# EAGLE schematic dig_ac230 (EAGLE 6.2)

## Sheet 1 of 4
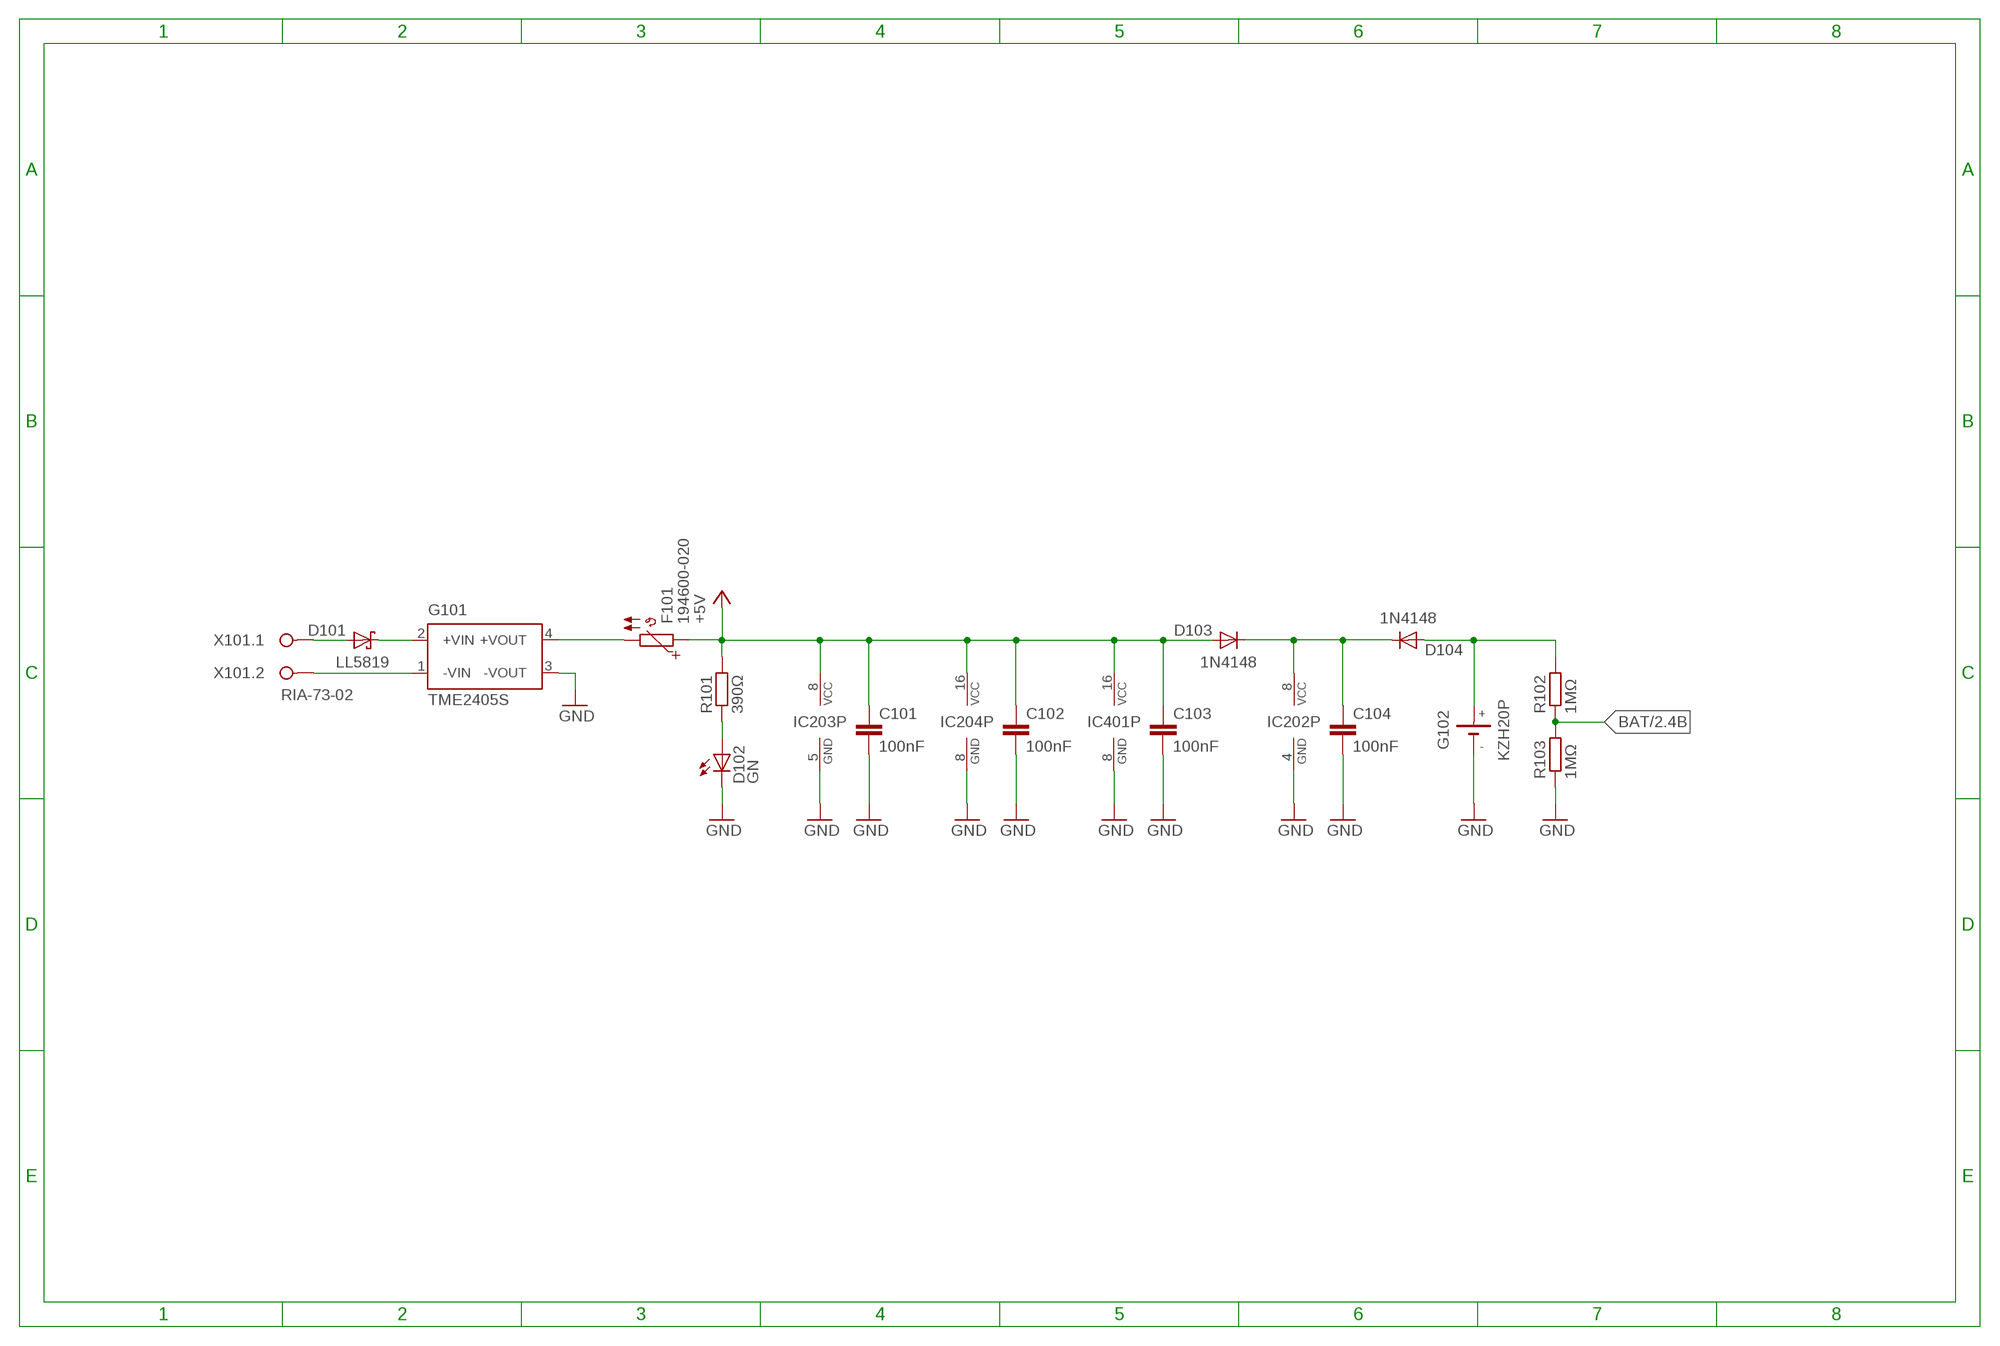
[diagram p0: schematic, sheet 1]

### Parts
C101  100nF  C_0805  [CHIP_0805]
C102  100nF  C_0805  [CHIP_0805]
C103  100nF  C_0805  [CHIP_0805]
C104  100nF  C_0805  [CHIP_0805]
D101  LL5819  SHOTKY-DIODE-MELF  [MELF]
D102  GN  LED3MM  [LED3MM]
D103  1N4148  DIODE-MINIMELF  [MINIMELF]
D104  1N4148  DIODE-MINIMELF  [MINIMELF]
F101  194600-020  [CHIP_1812]
G101  TME2405S  [TME-24V]
G102  KZH20P  [KZH20P]
IC202  DS1337S  [SOP08_127]
IC203  MAX487CSA  [SOP08_127]
IC204  74HC166D  [SOP16_127]
IC401  74HC595D  [SOP16_127]
R101  390Ω  R_0805  [CHIP_0805]
R102  1MΩ  R_0805  [CHIP_0805]
R103  1MΩ  R_0805  [CHIP_0805]
X101  RIA-73-02  [RIA-73-02]

### Nets
+5V: C101.1 C102.1 C103.1 D103.A F101.1 IC203.8(VCC) IC204.16(VCC) IC401.16(VCC) R101.2 ; also sheet 2,3
BAT: R102.1 R103.2 ; also sheet 2
GND: C101.2 C102.2 C103.2 C104.2 D102.K(C) G101.3(-VOUT) G102.N(-) IC202.4(GND) IC203.5(GND) IC204.8(GND) IC401.8(GND) R103.1 ; also sheet 2,3,4
N$19: G101.1(-VIN) X101.2
N$21: D104.A G102.P1(+) G102.P2(+) R102.2
N$23: D101.K G101.2(+VIN)
N$24: D101.A X101.1
N$41: F101.2 G101.4(+VOUT)
N$44: D102.A R101.1
N$64: C104.1 D103.K D104.K IC202.8(VCC)

## Sheet 2 of 4
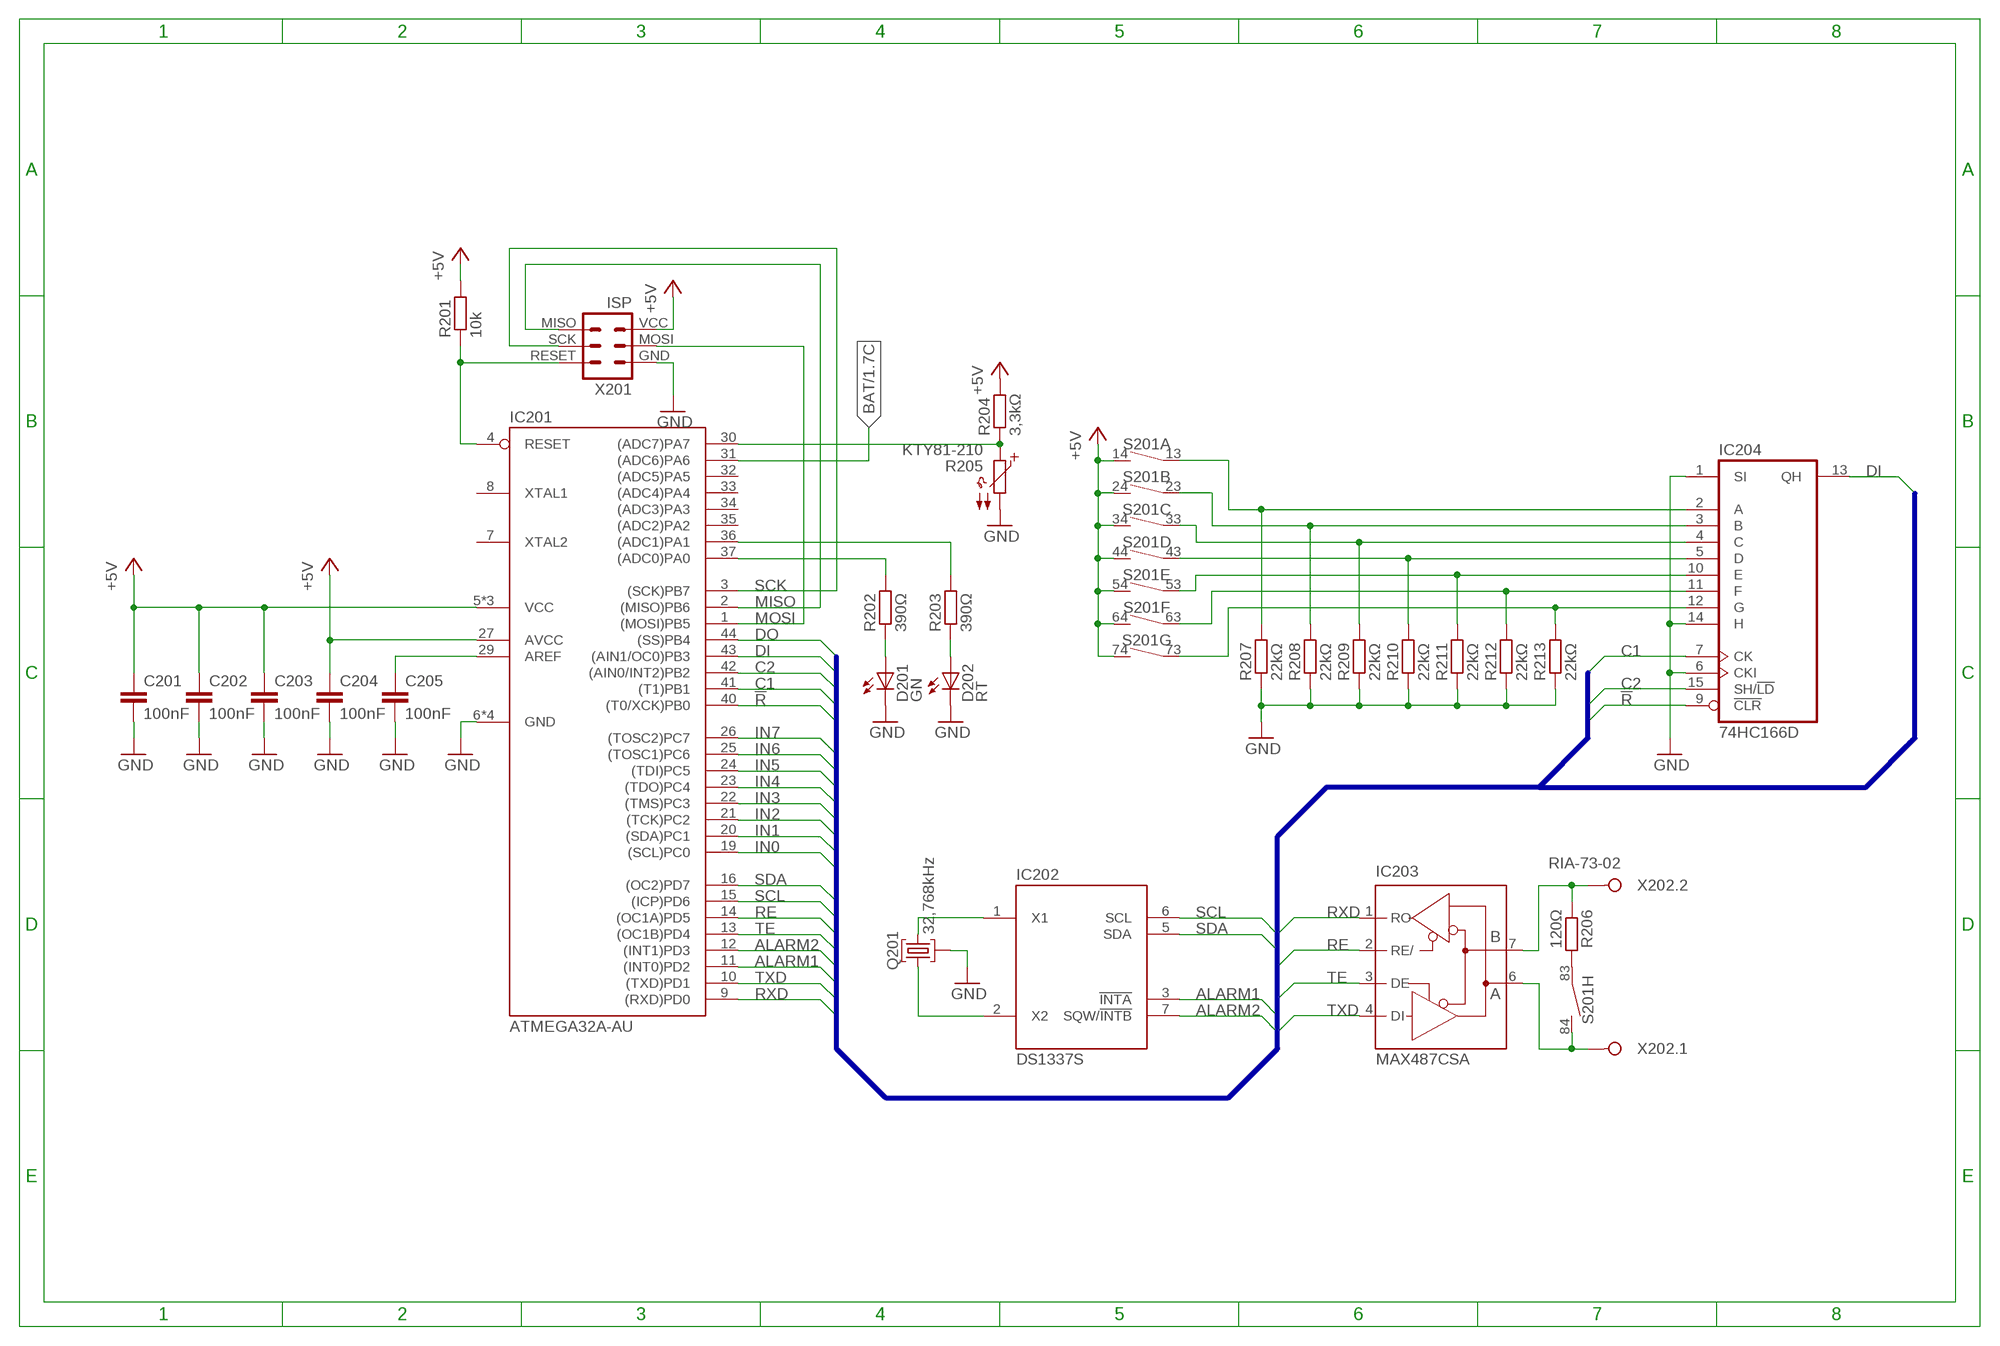
[diagram p1: schematic, sheet 2]

### Parts
C201  100nF  C_0805  [CHIP_0805]
C202  100nF  C_0805  [CHIP_0805]
C203  100nF  C_0805  [CHIP_0805]
C204  100nF  C_0805  [CHIP_0805]
C205  100nF  C_0805  [CHIP_0805]
D201  GN  LED3MM  [LED3MM]
D202  RT  LED3MM  [LED3MM]
IC201  ATMEGA32A-AU  [QFP44_08]
Q201  32,768kHz  QM_  [MS1V-T1K]
R201  10k  R_0805  [CHIP_0805]
R202  390Ω  R_0805  [CHIP_0805]
R203  390Ω  R_0805  [CHIP_0805]
R204  3,3kΩ  R_0805  [CHIP_0805]
R205  KTY81-210  [TO92]
R206  120Ω  R_0805  [CHIP_0805]
R207  22kΩ  R_0805  [CHIP_0805]
R208  22kΩ  R_0805  [CHIP_0805]
R209  22kΩ  R_0805  [CHIP_0805]
R210  22kΩ  R_0805  [CHIP_0805]
R211  22kΩ  R_0805  [CHIP_0805]
R212  22kΩ  R_0805  [CHIP_0805]
R213  22kΩ  R_0805  [CHIP_0805]
S201  DP08  [DP08]
X201  ISP  AVR_ISP6L  [ML6L]
X202  RIA-73-02  [RIA-73-02]

### Nets
!R: IC201.40((T0/XCK)PB0) IC204.9(!CLR) ; also sheet 4
+5V: C201.1 C202.1 C203.1 C204.1 IC201.5(VCC) IC201.17(VCC) IC201.27(AVCC) IC201.38(VCC) R201.2 R204.2 S201.14 S201.24 S201.34 S201.44 S201.54 S201.64 S201.74 X201.VCC ; also sheet 1,3
ALARM1: IC201.11((INT0)PD2) IC202.3(!INTA)
ALARM2: IC201.12((INT1)PD3) IC202.7(SQW/!INTB)
BAT: IC201.31((ADC6)PA6) ; also sheet 1
C1: IC201.41((T1)PB1) IC204.7(CK) ; also sheet 4
C2: IC201.42((AIN0/INT2)PB2) IC204.15(SH/!LD) ; also sheet 4
DI: IC201.43((AIN1/OC0)PB3) IC204.13(QH)
DO: IC201.44((SS)PB4) ; also sheet 4
GND: C201.2 C202.2 C203.2 C204.2 C205.2 D201.K(C) D202.K(C) IC201.6(GND) IC201.18(GND) IC201.28(GND) IC201.39(GND) IC204.1(SI) IC204.6(CKI) IC204.14(H) Q201.G R205.2 R207.1 R208.1 R209.1 R210.1 R211.1 R212.1 R213.1 X201.GND ; also sheet 1,3,4
IN0: IC201.19((SCL)PC0) ; also sheet 3
IN1: IC201.20((SDA)PC1) ; also sheet 3
IN2: IC201.21((TCK)PC2) ; also sheet 3
IN3: IC201.22((TMS)PC3) ; also sheet 3
IN4: IC201.23((TDO)PC4) ; also sheet 3
IN5: IC201.24((TDI)PC5) ; also sheet 3
IN6: IC201.25((TOSC1)PC6) ; also sheet 3
IN7: IC201.26((TOSC2)PC7) ; also sheet 3
MISO: IC201.2((MISO)PB6) X201.MISO
MOSI: IC201.1((MOSI)PB5) X201.MOSI
N$20: IC203.6(A) S201.84 X202.1
N$22: IC203.7(B) R206.1 X202.2
N$25: C205.1 IC201.29(AREF)
N$26: IC204.2(A) R207.2 S201.13
N$27: IC204.3(B) R208.2 S201.23
N$28: IC204.4(C) R209.2 S201.33
N$29: IC204.5(D) R210.2 S201.43
N$30: IC204.10(E) R211.2 S201.53
N$31: IC204.11(F) R212.2 S201.63
N$32: IC204.12(G) R213.2 S201.73
N$33: R206.2 S201.83
N$42: IC201.4(RESET) R201.1 X201.RESET
N$61: IC201.30((ADC7)PA7) R204.1 R205.1
N$62: D201.A R202.1
N$63: D202.A R203.1
N$90: IC201.37((ADC0)PA0) R202.2
N$92: IC201.36((ADC1)PA1) R203.2
N$126: IC202.1(X1) Q201.2
N$127: IC202.2(X2) Q201.1
RE: IC201.14((OC1A)PD5) IC203.2(RE/)
RXD: IC201.9((RXD)PD0) IC203.1(RO)
SCK: IC201.3((SCK)PB7) X201.SCK
SCL: IC201.15((ICP)PD6) IC202.6(SCL)
SDA: IC201.16((OC2)PD7) IC202.5(SDA)
TE: IC201.13((OC1B)PD4) IC203.3(DE)
TXD: IC201.10((TXD)PD1) IC203.4(DI)
Unconnected: IC201.7(XTAL2) IC201.8(XTAL1) IC201.32((ADC5)PA5) IC201.33((ADC4)PA4) IC201.34((ADC3)PA3) IC201.35((ADC2)PA2)

### Buses
IN[0..7],C1,C2,DO,DI,!R,RXD,TXD,RE,TE,SCL,SDA,ALARM1,ALARM2

## Sheet 3 of 4
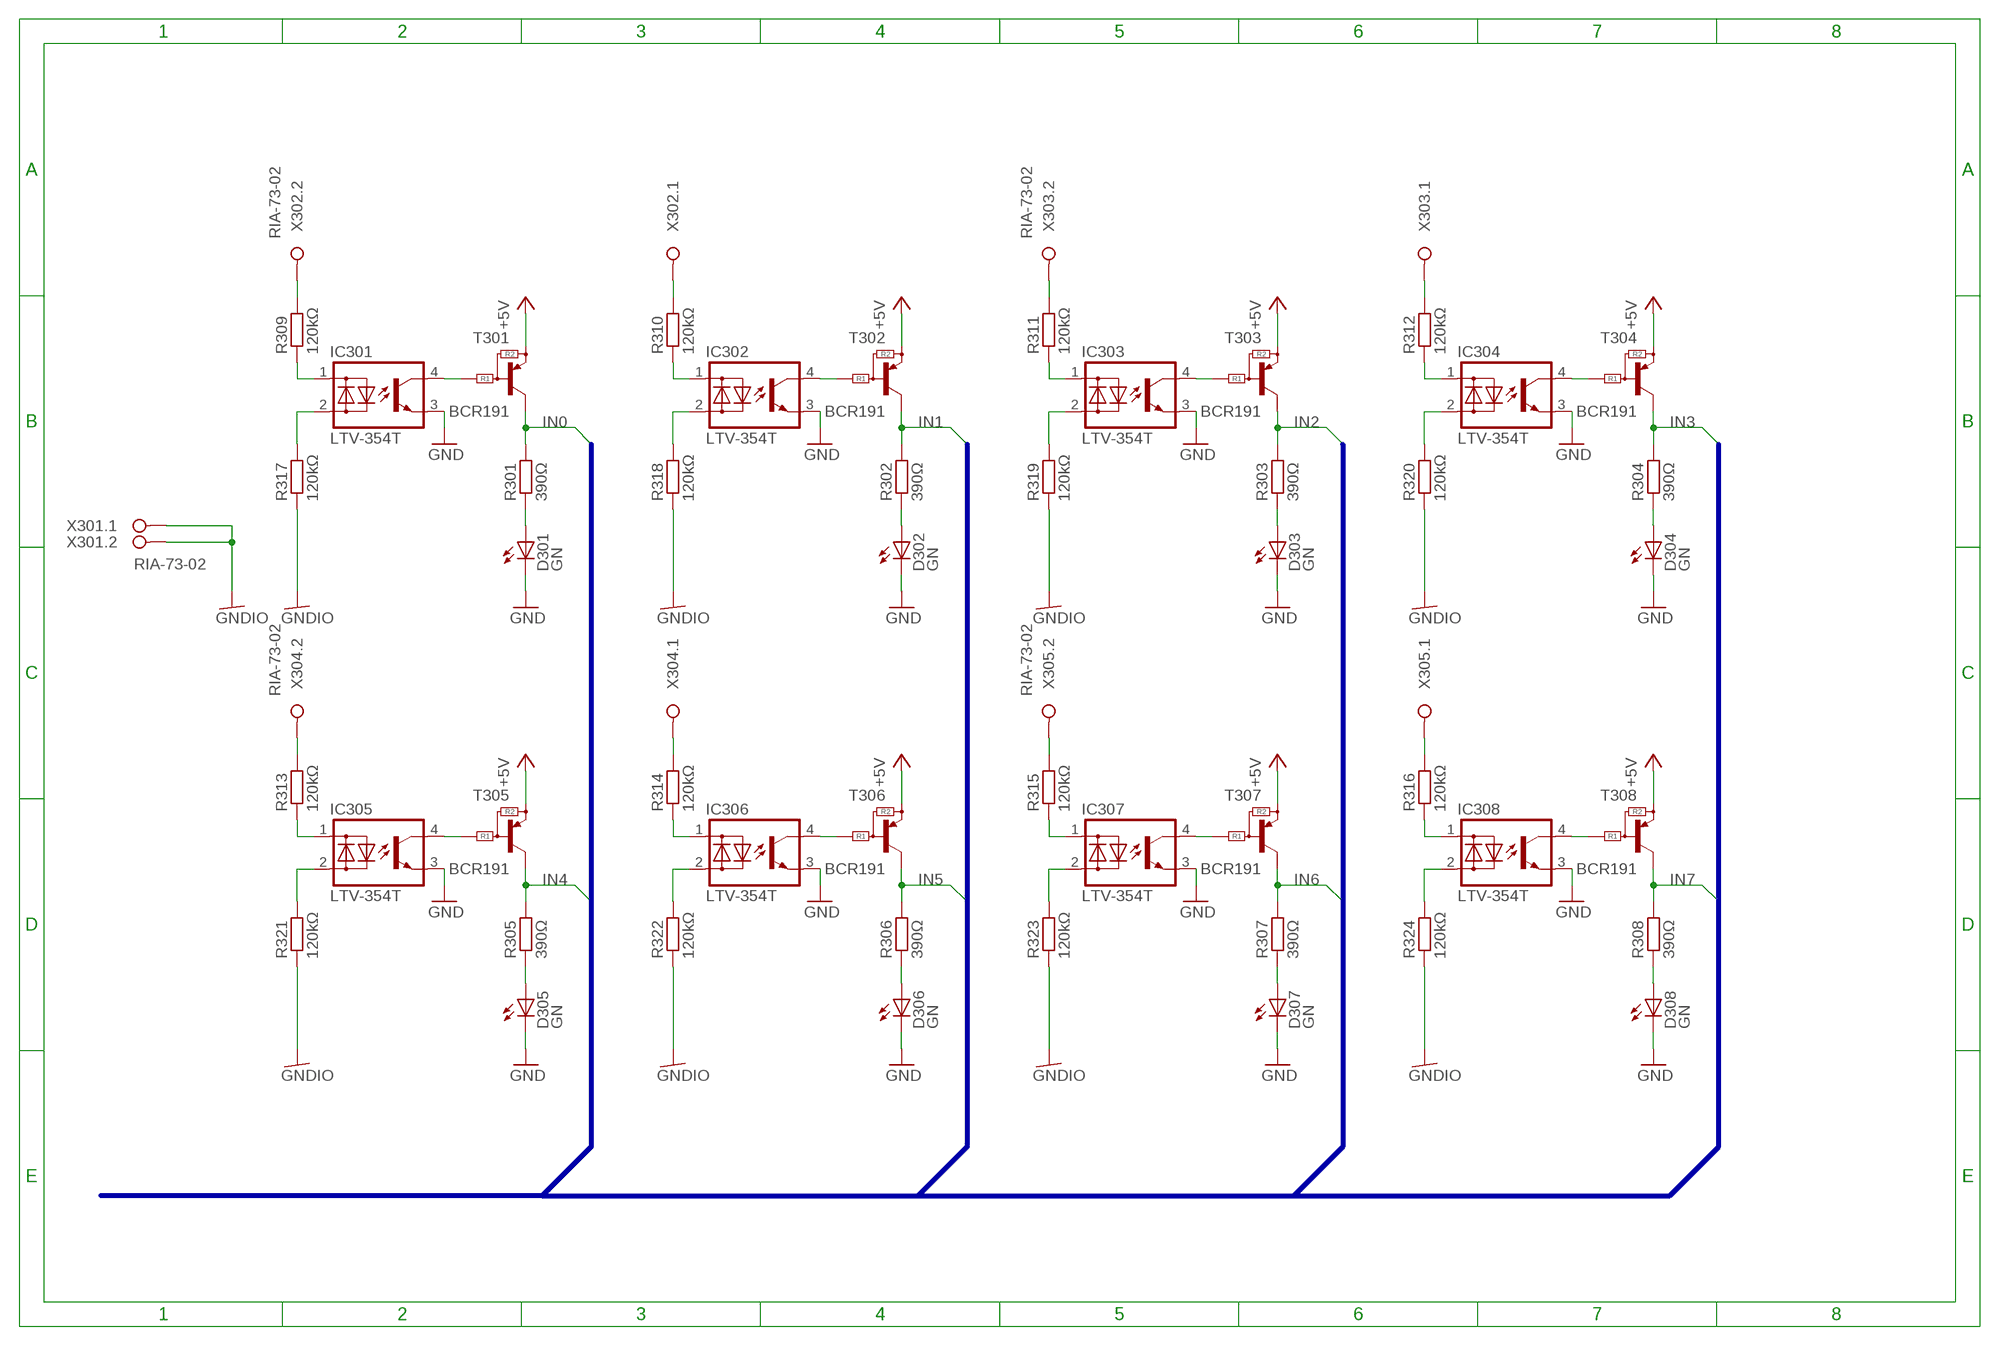
[diagram p2: schematic, sheet 3]

### Parts
D301  GN  LED3MM  [LED3MM]
D302  GN  LED3MM  [LED3MM]
D303  GN  LED3MM  [LED3MM]
D304  GN  LED3MM  [LED3MM]
D305  GN  LED3MM  [LED3MM]
D306  GN  LED3MM  [LED3MM]
D307  GN  LED3MM  [LED3MM]
D308  GN  LED3MM  [LED3MM]
IC301  LTV-354T  [SOP04_254]
IC302  LTV-354T  [SOP04_254]
IC303  LTV-354T  [SOP04_254]
IC304  LTV-354T  [SOP04_254]
IC305  LTV-354T  [SOP04_254]
IC306  LTV-354T  [SOP04_254]
IC307  LTV-354T  [SOP04_254]
IC308  LTV-354T  [SOP04_254]
R301  390Ω  R_0805  [CHIP_0805]
R302  390Ω  R_0805  [CHIP_0805]
R303  390Ω  R_0805  [CHIP_0805]
R304  390Ω  R_0805  [CHIP_0805]
R305  390Ω  R_0805  [CHIP_0805]
R306  390Ω  R_0805  [CHIP_0805]
R307  390Ω  R_0805  [CHIP_0805]
R308  390Ω  R_0805  [CHIP_0805]
R309  120kΩ  R_1206  [CHIP_1206]
R310  120kΩ  R_1206  [CHIP_1206]
R311  120kΩ  R_1206  [CHIP_1206]
R312  120kΩ  R_1206  [CHIP_1206]
R313  120kΩ  R_1206  [CHIP_1206]
R314  120kΩ  R_1206  [CHIP_1206]
R315  120kΩ  R_1206  [CHIP_1206]
R316  120kΩ  R_1206  [CHIP_1206]
R317  120kΩ  R_1206  [CHIP_1206]
R318  120kΩ  R_1206  [CHIP_1206]
R319  120kΩ  R_1206  [CHIP_1206]
R320  120kΩ  R_1206  [CHIP_1206]
R321  120kΩ  R_1206  [CHIP_1206]
R322  120kΩ  R_1206  [CHIP_1206]
R323  120kΩ  R_1206  [CHIP_1206]
R324  120kΩ  R_1206  [CHIP_1206]
T301  BCR191  PNP2R-SOT23-BEC  [SOT23]
T302  BCR191  PNP2R-SOT23-BEC  [SOT23]
T303  BCR191  PNP2R-SOT23-BEC  [SOT23]
T304  BCR191  PNP2R-SOT23-BEC  [SOT23]
T305  BCR191  PNP2R-SOT23-BEC  [SOT23]
T306  BCR191  PNP2R-SOT23-BEC  [SOT23]
T307  BCR191  PNP2R-SOT23-BEC  [SOT23]
T308  BCR191  PNP2R-SOT23-BEC  [SOT23]
X301  RIA-73-02  [RIA-73-02]
X302  RIA-73-02  [RIA-73-02]
X303  RIA-73-02  [RIA-73-02]
X304  RIA-73-02  [RIA-73-02]
X305  RIA-73-02  [RIA-73-02]

### Nets
+5V: T301.2(E) T302.2(E) T303.2(E) T304.2(E) T305.2(E) T306.2(E) T307.2(E) T308.2(E) ; also sheet 1,2
GND: D301.K(C) D302.K(C) D303.K(C) D304.K(C) D305.K(C) D306.K(C) D307.K(C) D308.K(C) IC301.3(E) IC302.3(E) IC303.3(E) IC304.3(E) IC305.3(E) IC306.3(E) IC307.3(E) IC308.3(E) ; also sheet 1,2,4
GNDIO [netz]: R317.1 R318.1 R319.1 R320.1 R321.1 R322.1 R323.1 R324.1 X301.1 X301.2
IN0: R301.2 T301.3(C) ; also sheet 2
IN1: R302.2 T302.3(C) ; also sheet 2
IN2: R303.2 T303.3(C) ; also sheet 2
IN3: R304.2 T304.3(C) ; also sheet 2
IN4: R305.2 T305.3(C) ; also sheet 2
IN5: R306.2 T306.3(C) ; also sheet 2
IN6: R307.2 T307.3(C) ; also sheet 2
IN7: R308.2 T308.3(C) ; also sheet 2
N$1 [netz]: R309.2 X302.2
N$2 [netz]: IC301.1(A) R309.1
N$3 [netz]: IC301.2(K) R317.2
N$4 [netz]: R310.2 X302.1
N$5 [netz]: IC302.1(A) R310.1
N$6 [netz]: IC302.2(K) R318.2
N$7 [netz]: R311.2 X303.2
N$8 [netz]: IC303.1(A) R311.1
N$9 [netz]: IC303.2(K) R319.2
N$10 [netz]: R312.2 X303.1
N$11 [netz]: IC304.1(A) R312.1
N$12 [netz]: IC304.2(K) R320.2
N$13 [netz]: R313.2 X304.2
N$14 [netz]: IC305.1(A) R313.1
N$15 [netz]: IC305.2(K) R321.2
N$16 [netz]: R314.2 X304.1
N$34: D304.A R304.1
N$35 [netz]: IC306.1(A) R314.1
N$36: D303.A R303.1
N$37 [netz]: IC306.2(K) R322.2
N$38: D302.A R302.1
N$39 [netz]: IC307.1(A) R315.1
N$40: D301.A R301.1
N$50 [netz]: IC307.2(K) R323.2
N$52: IC304.4(C) T304.1(B)
N$55: D305.A R305.1
N$57 [netz]: R315.2 X305.2
N$65: D306.A R306.1
N$67 [netz]: R316.2 X305.1
N$69: D307.A R307.1
N$70: IC303.4(C) T303.1(B)
N$71 [netz]: IC308.1(A) R316.1
N$73: IC302.4(C) T302.1(B)
N$75: IC301.4(C) T301.1(B)
N$77: D308.A R308.1
N$79 [netz]: IC308.2(K) R324.2
N$80: IC305.4(C) T305.1(B)
N$81: IC306.4(C) T306.1(B)
N$83: IC307.4(C) T307.1(B)
N$85: IC308.4(C) T308.1(B)

### Buses
IN[0..7],C1,C2,DO,DI,!R,RXD,TXD,RE,TE,SCL,SDA,ALARM1,ALARM2

## Sheet 4 of 4
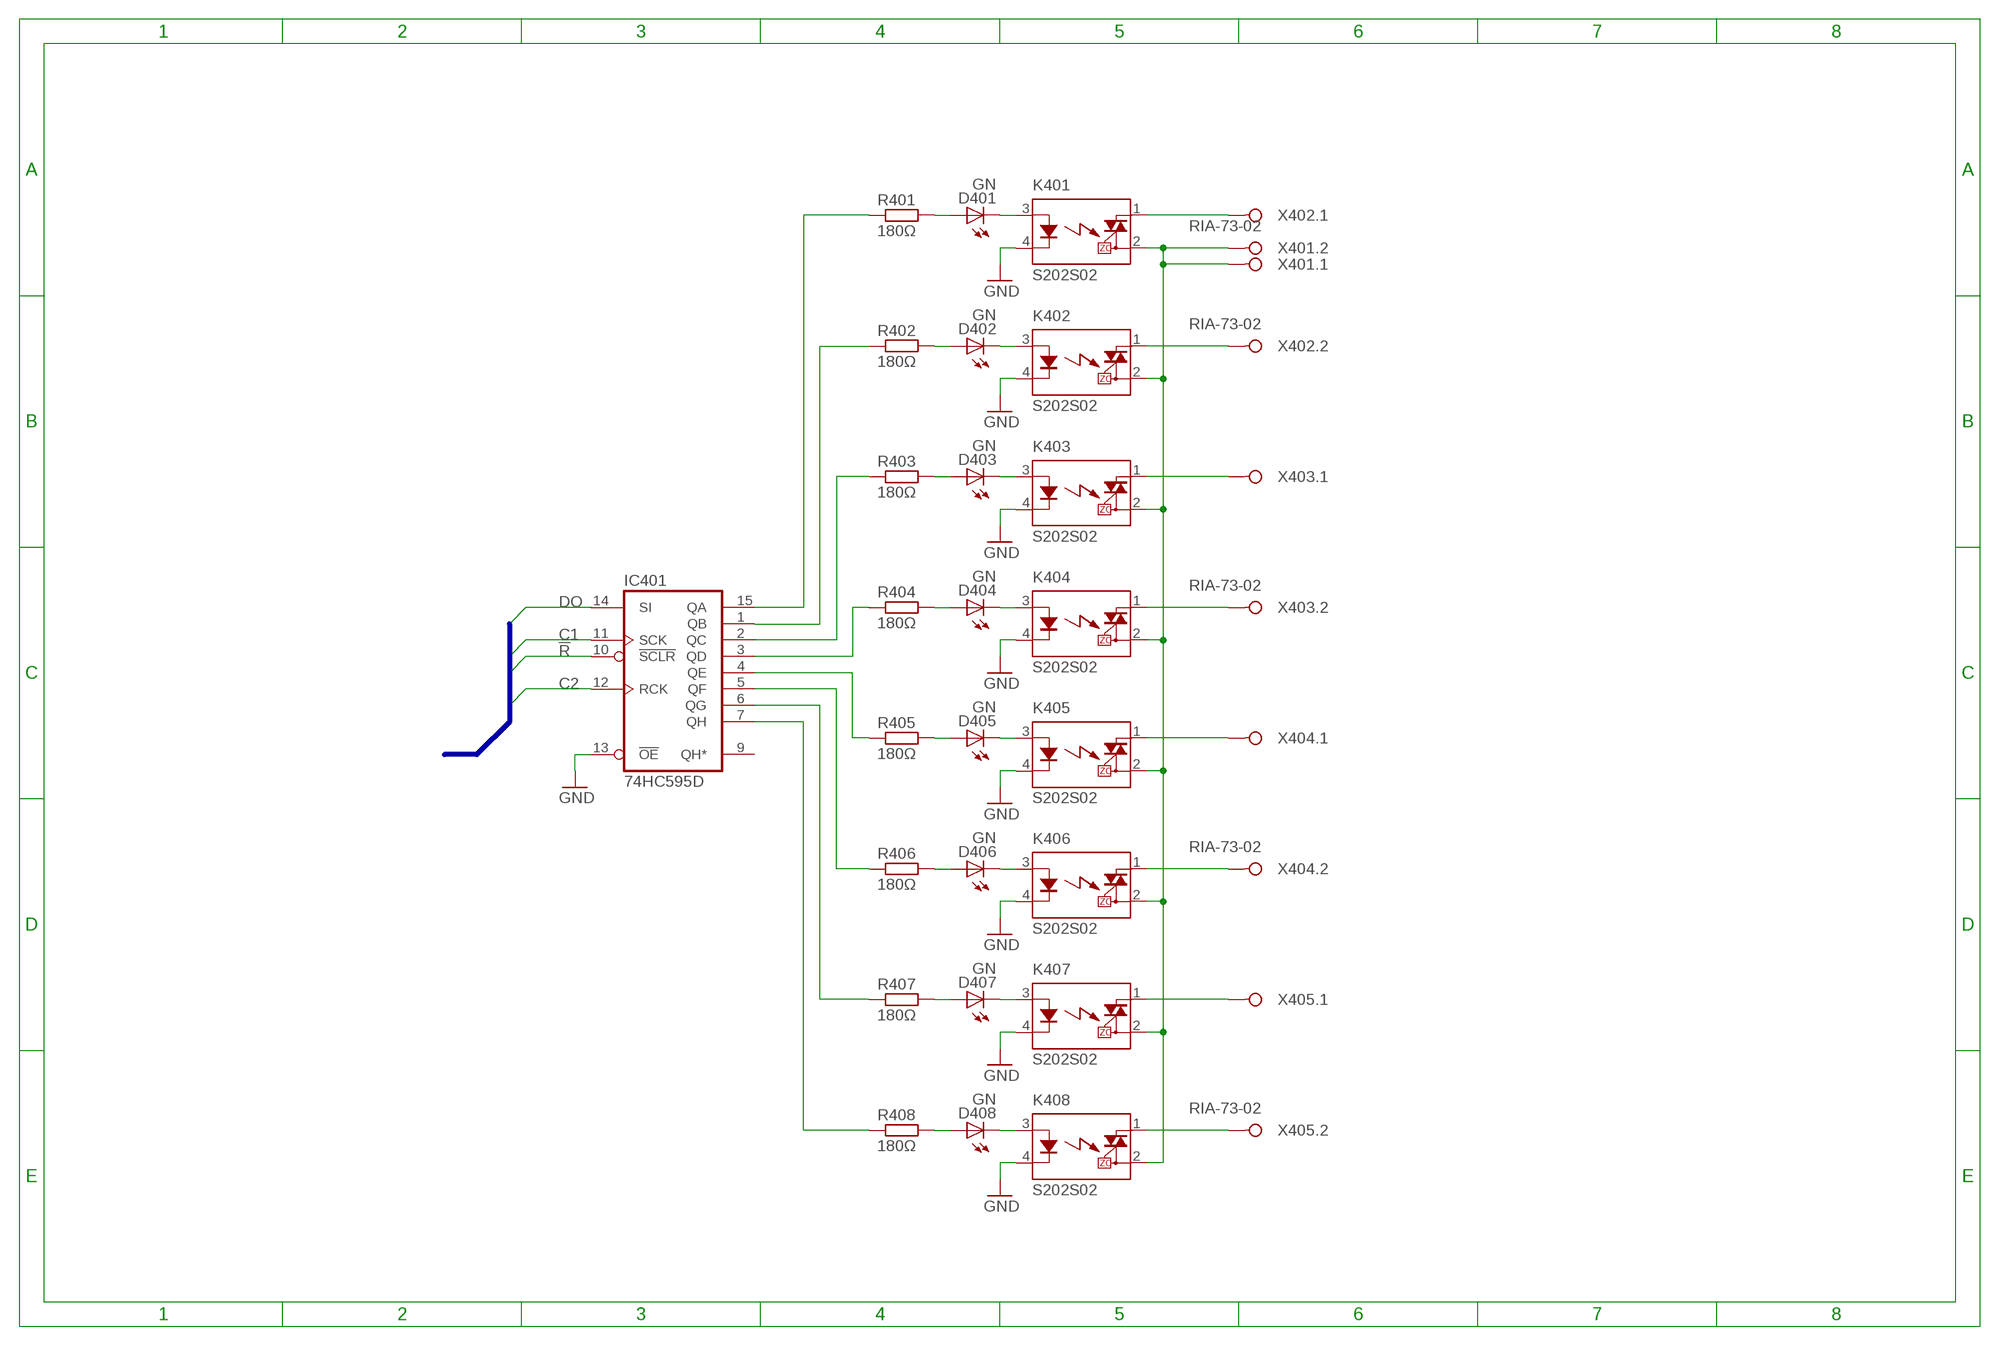
[diagram p3: schematic, sheet 4]

### Parts
D401  GN  LED3MM  [LED3MM]
D402  GN  LED3MM  [LED3MM]
D403  GN  LED3MM  [LED3MM]
D404  GN  LED3MM  [LED3MM]
D405  GN  LED3MM  [LED3MM]
D406  GN  LED3MM  [LED3MM]
D407  GN  LED3MM  [LED3MM]
D408  GN  LED3MM  [LED3MM]
K401  S202S02  [SIP4]
K402  S202S02  [SIP4]
K403  S202S02  [SIP4]
K404  S202S02  [SIP4]
K405  S202S02  [SIP4]
K406  S202S02  [SIP4]
K407  S202S02  [SIP4]
K408  S202S02  [SIP4]
R401  180Ω  R_0805  [CHIP_0805]
R402  180Ω  R_0805  [CHIP_0805]
R403  180Ω  R_0805  [CHIP_0805]
R404  180Ω  R_0805  [CHIP_0805]
R405  180Ω  R_0805  [CHIP_0805]
R406  180Ω  R_0805  [CHIP_0805]
R407  180Ω  R_0805  [CHIP_0805]
R408  180Ω  R_0805  [CHIP_0805]
X401  RIA-73-02  [RIA-73-02]
X402  RIA-73-02  [RIA-73-02]
X403  RIA-73-02  [RIA-73-02]
X404  RIA-73-02  [RIA-73-02]
X405  RIA-73-02  [RIA-73-02]

### Nets
!R: IC401.10(!SCLR) ; also sheet 2
C1: IC401.11(SCK) ; also sheet 2
C2: IC401.12(RCK) ; also sheet 2
DO: IC401.14(SI) ; also sheet 2
GND: IC401.13(!OE) K401.4(K) K402.4(K) K403.4(K) K404.4(K) K405.4(K) K406.4(K) K407.4(K) K408.4(K) ; also sheet 1,2,3
L [netz]: K401.2(DS2) K402.2(DS2) K403.2(DS2) K404.2(DS2) K405.2(DS2) K406.2(DS2) K407.2(DS2) K408.2(DS2) X401.1 X401.2
N$17: D401.K(C) K401.3(A)
N$18: D402.K(C) K402.3(A)
N$43: D403.K(C) K403.3(A)
N$45: D404.K(C) K404.3(A)
N$46: D405.K(C) K405.3(A)
N$47: D406.K(C) K406.3(A)
N$48: D407.K(C) K407.3(A)
N$49: D408.K(C) K408.3(A)
N$51: IC401.15(QA) R401.1
N$53: IC401.1(QB) R402.1
N$54: IC401.2(QC) R403.1
N$56: IC401.3(QD) R404.1
N$58: IC401.4(QE) R405.1
N$59: IC401.5(QF) R406.1
N$60: IC401.6(QG) R407.1
N$66: IC401.7(QH) R408.1
N$68 [netz]: K401.1(DS1) X402.1
N$72 [netz]: K402.1(DS1) X402.2
N$74 [netz]: K403.1(DS1) X403.1
N$76 [netz]: K404.1(DS1) X403.2
N$78 [netz]: K405.1(DS1) X404.1
N$82 [netz]: K406.1(DS1) X404.2
N$84 [netz]: K407.1(DS1) X405.1
N$89 [netz]: K408.1(DS1) X405.2
N$103: D401.A R401.2
N$104: D402.A R402.2
N$105: D403.A R403.2
N$106: D404.A R404.2
N$107: D405.A R405.2
N$108: D406.A R406.2
N$109: D407.A R407.2
N$110: D408.A R408.2
Unconnected: IC401.9(QH*)

### Buses
IN[0..7],C1,C2,DO,DI,!R,RXD,TXD,RE,TE,SCL,SDA,ALARM1,ALARM2

## Library data of the parts
C101-C104 C201-C205 = passiv:C_: CAPACITOR, European symbol
D101 = diode:SHOTKY-DIODE
D102 D201 D202 D301-D308 D401-D408 = led:LED: LED
D103 D104 = diode:DIODE
F101 = sicherung:194600-*: Selbstrückstellende Sicherung / PTC-Fuse Datasheet: 194600.pdf <./eagle/doc/sicherung/194600.pdf>
G101 = schaltregler:TME?*: DC/DC Converter TME Series 1 Watt traco_tme.pdf <./eagle/doc/schaltregler/traco_tme.pdf>; MPN: TME 2405S; OC_FARNELL: 1007547; OC_NEWARK: 51R5329
G102 = batterie:KZH20: Knopfzellenhalter
IC201 = ic-mcu:ATMEGA32A: Microcontroller Typ Flash SRAM EEPROM GPIO ADC DAC PWM Timer Ports ATmega32A <./eagle/doc/ic-mcu/atmega32a.pdf> 32kB 2kB 1kB 32 8x 10bit 2x 8bit, 2x 16bit 2x 8bit, 1x 16bit JTAG, USART, I2C, SPI
IC202 = ic-controller:DS1337: Echtzeituhr Datasheet: ds1337.pdf <./eagle/doc/ic-controller/ds1337.pdf>
IC203 = ic-wandler:MAX48*: RS485 TRANSEIVER Datasheet: max1487-max491.pdf <./eagle/doc/ic-wandler/max1487-max491.pdf> Part Number Half- / Fullduplex Datarate (Mbps) Slew-Rate limited Low-Power shutdown Receiver / Driver enable Quiescent current (μA) Number of Receivers un bus MAX481 Half 2.5 No Yes Yes 300 32 MAX483 Half 0.25 Yes Yes Yes 120 32 MAX485 Half 2.5 No No Yes 300 32 MAX487 Half 0.25 Yes Yes Yes 120 128
IC204 = ic-logik:74*166: 8Bit Schiberegister PISO Datasheet: m74hc166.pdf <./eagle/doc/ic-logik/m74hc166.pdf> Pin Bedeutung Beschreibung SI Shift input Serieller Daten eingang CK Cock Daten weiterschieben bei positiver Flanke CKI Cock inhibit Clock bei L freischalten SH/LD Shift / Load L läd bei Clock die Daten CLR Clear Schieberegister wird bei L gelöscht
IC301-IC308 = ic-optokoppler:LTV-354T: Liteon Optokoppler ltv-354t.pdf <./eagle/doc/ic-optokoppler/ltv-354t.pdf>
IC401 = ic-logik:74*595: 8Bit Schiberegister SIPO Datasheet: m74hc595.pdf <./eagle/doc/ic-logik/m74hc595.pdf> Pin Bedeutung Beschreibung SI Shift input Serieller Daten eingang SCK Shift cock Daten weiterschieben bei positiver Flanke SCLR Shift clear Schieberegister wird bei L gelöscht RCK Register cock Daten vom Schieberegister werden bei positiver Flanke in den Latch übertragen OE Output enable Ausgänge bei L aktiv
K401-K408 = relais:S*02S02: IT(rms) 8A, Zero Cross type SIP 4pin Triac output SSR s102s02.pdf <./eagle/doc/relais/s102s02.pdf>; VDRM: 600
Q201 = passiv:QM_: SMD Quarz Datasheet: ms1v-t1k.pdf <./eagle/doc/passiv/ms1v-t1k.pdf>
R101-R103 R201-R204 R206-R213 R301-R324 R401-R408 = passiv:R_: RESISTOR, European symbol
R205 = sensor:KTY81: Silikon Temperatursensor Datasheet: kty81-1.pdf <./eagle/doc/sensor/kty81-1.pdf> / kty81-2.pdf <./eagle/doc/sensor/kty81-2.pdf>
S201 = schalter:DP08: Piano-Dip-Schalter Datasheet: dp.pdf <./eagle/doc/schalter/dp.pdf>
T301-T308 = transistor:PNP2R: PNP Digitaltransistor Typ Variant VCEO (V) IC (mA) PD (mW) R1 (kOhm) R2 (kOhm) Source BCR191 SOT23-BEC -50 -100 200 22 22 bcr191.pdf <./eagle/doc/transistor/bcr191.pdf>
X101 X202 X301-X305 X401-X405 = anschluss:RIA-73-02
X201 = stecker:AVR_ISP6: HARTING

## Net classes
1 netz: clearance 3 mm to class 0, clearance 1 mm